# EAGLE design pimotor (EAGLE 6.5.0)
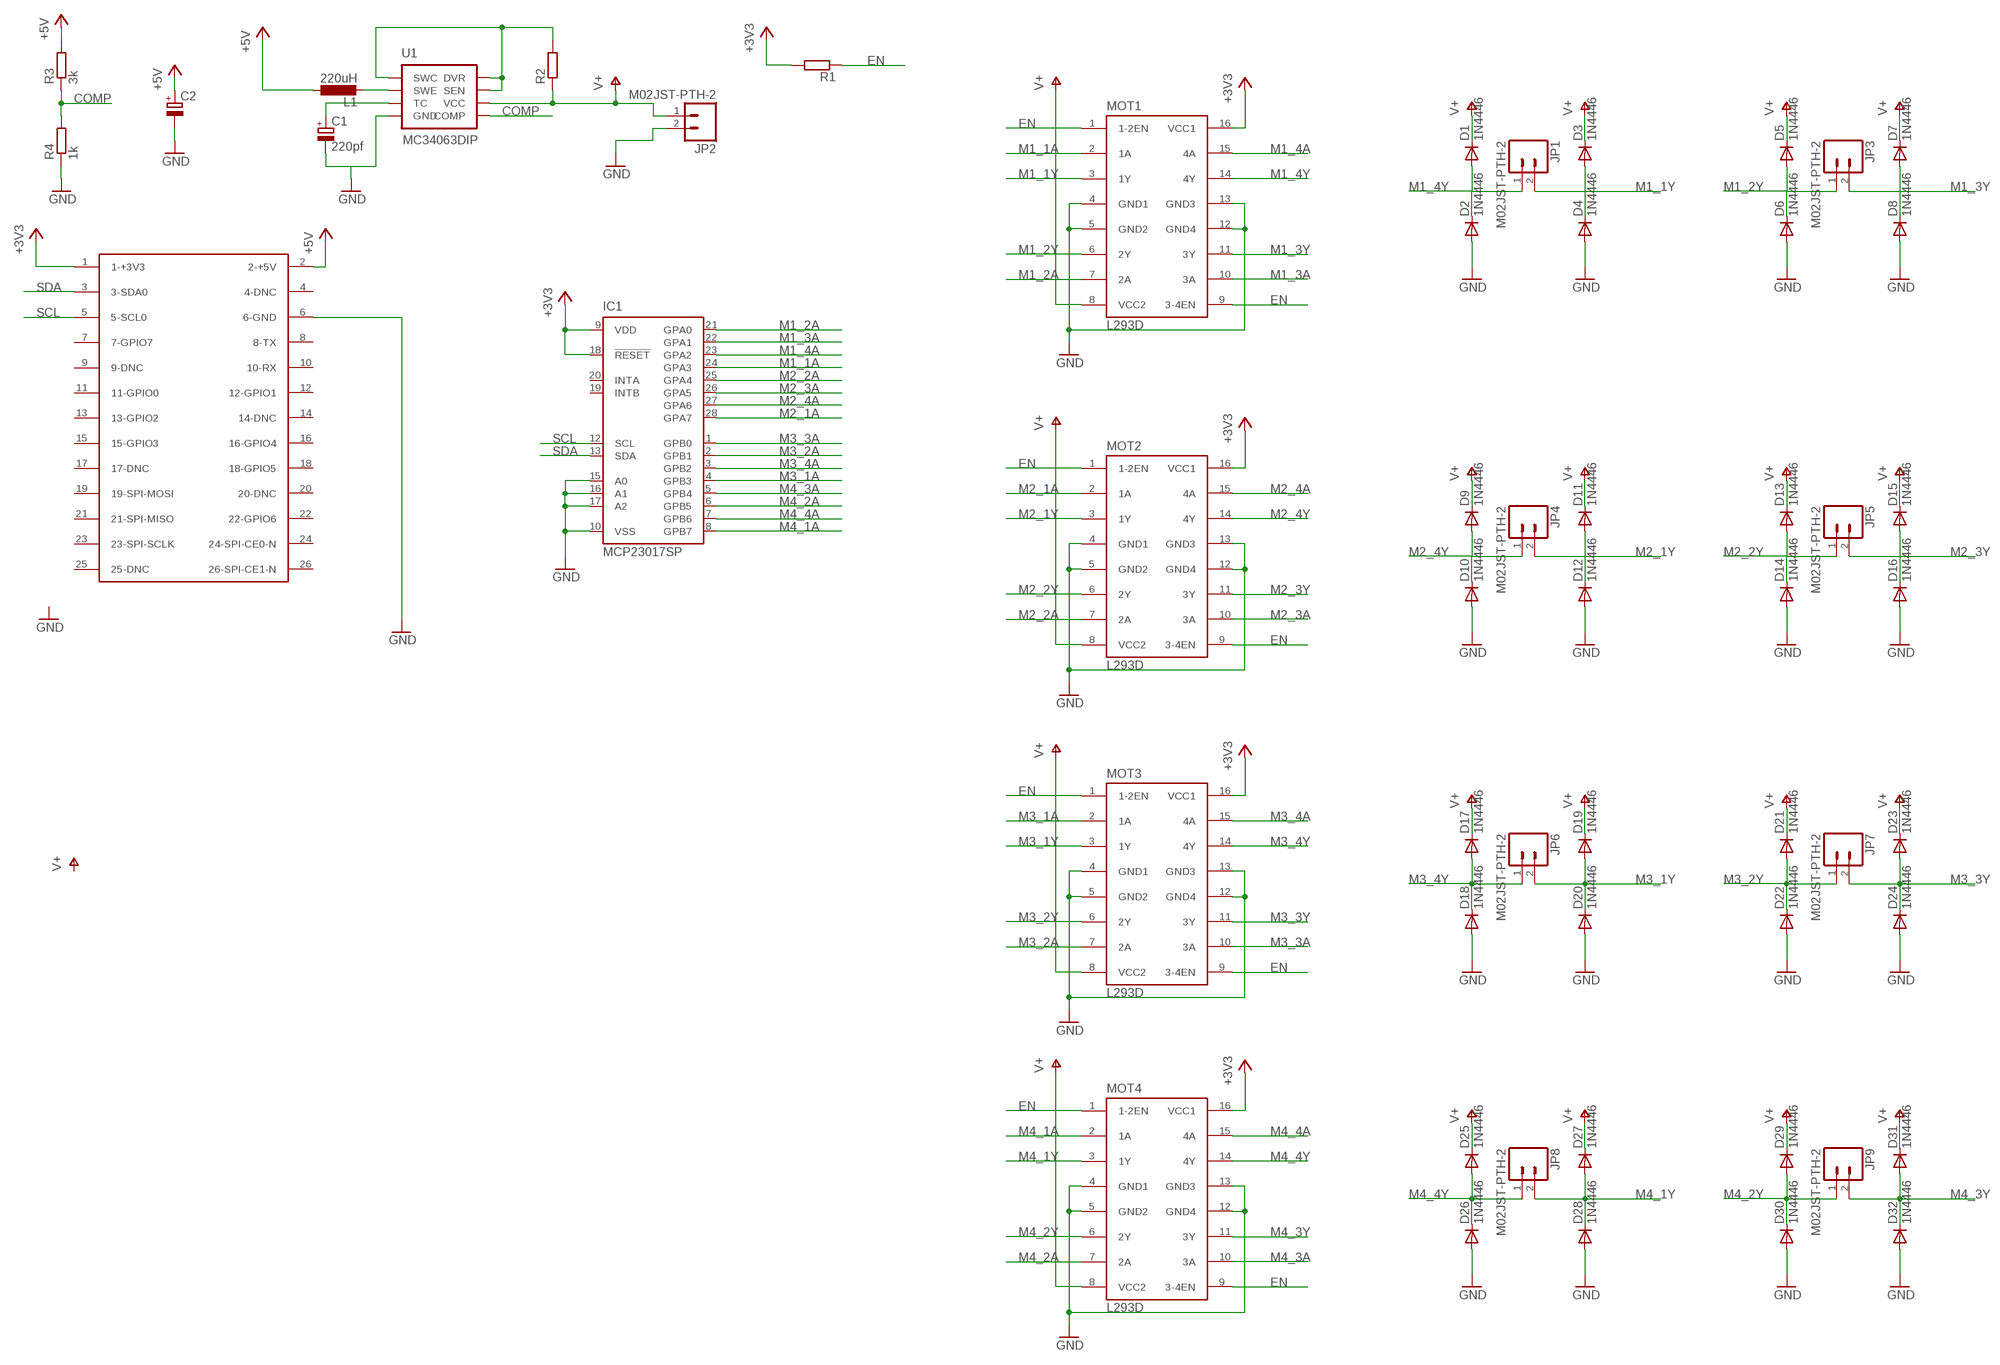
[diagram p0: schematic, sheet 1]

## Parts
C1  220pf  CPOL-EUE3.5-8  [E3,5-8]
C2  CPOL-EUE3.5-8  [E3,5-8]
D1  1N4446  [DO35-10]
D2  1N4446  [DO35-10]
D3  1N4446  [DO35-10]
D4  1N4446  [DO35-10]
D5  1N4446  [DO35-10]
D6  1N4446  [DO35-10]
D7  1N4446  [DO35-10]
D8  1N4446  [DO35-10]
D9  1N4446  [DO35-10]
D10  1N4446  [DO35-10]
D11  1N4446  [DO35-10]
D12  1N4446  [DO35-10]
D13  1N4446  [DO35-10]
D14  1N4446  [DO35-10]
D15  1N4446  [DO35-10]
D16  1N4446  [DO35-10]
D17  1N4446  [DO35-10]
D18  1N4446  [DO35-10]
D19  1N4446  [DO35-10]
D20  1N4446  [DO35-10]
D21  1N4446  [DO35-10]
D22  1N4446  [DO35-10]
D23  1N4446  [DO35-10]
D24  1N4446  [DO35-10]
D25  1N4446  [DO35-10]
D26  1N4446  [DO35-10]
D27  1N4446  [DO35-10]
D28  1N4446  [DO35-10]
D29  1N4446  [DO35-10]
D30  1N4446  [DO35-10]
D31  1N4446  [DO35-10]
D32  1N4446  [DO35-10]
IC1  MCP23017SP  [DIL28-3]
JP1  M02JST-PTH-2  [JST-2-PTH]
JP2  M02JST-PTH-2  [JST-2-PTH]
JP3  M02JST-PTH-2  [JST-2-PTH]
JP4  M02JST-PTH-2  [JST-2-PTH]
JP5  M02JST-PTH-2  [JST-2-PTH]
JP6  M02JST-PTH-2  [JST-2-PTH]
JP7  M02JST-PTH-2  [JST-2-PTH]
JP8  M02JST-PTH-2  [JST-2-PTH]
JP9  M02JST-PTH-2  [JST-2-PTH]
L1  220uH  L-EU0204/7  [0204/7]
MOT1  L293D  [DIL16]
MOT2  L293D  [DIL16]
MOT3  L293D  [DIL16]
MOT4  L293D  [DIL16]
R1  R-EU_0204/7  [0204/7]
R2  R-EU_0204/7  [0204/7]
R3  3k  R-EU_0204/7  [0204/7]
R4  1k  R-EU_0204/7  [0204/7]
U1  MC34063DIP  [DIP-08]
U$1  RASPBERRY-PI  [RASPBERRY-PI]

## Nets
+3V3: IC1.9(VDD) IC1.18(!RESET) MOT1.16(VCC1) MOT2.16(VCC1) MOT3.16(VCC1) MOT4.16(VCC1) R1.2 U$1.1(1-+3V3)
+5V: C2.+ L1.1 R3.2 U$1.2(2-+5V)
COMP: R3.1 R4.2 U1.5(COMP)
EN: MOT1.1(1-2EN) MOT1.9(3-4EN) MOT2.1(1-2EN) MOT2.9(3-4EN) MOT3.1(1-2EN) MOT3.9(3-4EN) MOT4.1(1-2EN) MOT4.9(3-4EN) R1.1
GND: C1.- C2.- D2.A D4.A D6.A D8.A D10.A D12.A D14.A D16.A D18.A D20.A D22.A D24.A D26.A D28.A D30.A D32.A IC1.10(VSS) IC1.15(A0) IC1.16(A1) IC1.17(A2) JP2.2 MOT1.4(GND1) MOT1.5(GND2) MOT1.12(GND4) MOT1.13(GND3) MOT2.4(GND1) MOT2.5(GND2) MOT2.12(GND4) MOT2.13(GND3) MOT3.4(GND1) MOT3.5(GND2) MOT3.12(GND4) MOT3.13(GND3) MOT4.4(GND1) MOT4.5(GND2) MOT4.12(GND4) MOT4.13(GND3) R4.1 U1.4(GND) U$1.6(6-GND)
M1_1A: IC1.24(GPA3) MOT1.2(1A)
M1_1Y: D3.A D4.C JP1.2 MOT1.3(1Y)
M1_2A: IC1.21(GPA0) MOT1.7(2A)
M1_2Y: D5.A D6.C JP3.1 MOT1.6(2Y)
M1_3A: IC1.22(GPA1) MOT1.10(3A)
M1_3Y: D7.A D8.C JP3.2 MOT1.11(3Y)
M1_4A: IC1.23(GPA2) MOT1.15(4A)
M1_4Y: D1.A D2.C JP1.1 MOT1.14(4Y)
M2_1A: IC1.28(GPA7) MOT2.2(1A)
M2_1Y: D11.A D12.C JP4.2 MOT2.3(1Y)
M2_2A: IC1.25(GPA4) MOT2.7(2A)
M2_2Y: D13.A D14.C JP5.1 MOT2.6(2Y)
M2_3A: IC1.26(GPA5) MOT2.10(3A)
M2_3Y: D15.A D16.C JP5.2 MOT2.11(3Y)
M2_4A: IC1.27(GPA6) MOT2.15(4A)
M2_4Y: D9.A D10.C JP4.1 MOT2.14(4Y)
M3_1A: IC1.4(GPB3) MOT3.2(1A)
M3_1Y: D19.A D20.C JP6.2 MOT3.3(1Y)
M3_2A: IC1.2(GPB1) MOT3.7(2A)
M3_2Y: D21.A D22.C JP7.1 MOT3.6(2Y)
M3_3A: IC1.1(GPB0) MOT3.10(3A)
M3_3Y: D23.A D24.C JP7.2 MOT3.11(3Y)
M3_4A: IC1.3(GPB2) MOT3.15(4A)
M3_4Y: D17.A D18.C JP6.1 MOT3.14(4Y)
M4_1A: IC1.8(GPB7) MOT4.2(1A)
M4_1Y: D27.A D28.C JP8.2 MOT4.3(1Y)
M4_2A: IC1.6(GPB5) MOT4.7(2A)
M4_2Y: D29.A D30.C JP9.1 MOT4.6(2Y)
M4_3A: IC1.5(GPB4) MOT4.10(3A)
M4_3Y: D31.A D32.C JP9.2 MOT4.11(3Y)
M4_4A: IC1.7(GPB6) MOT4.15(4A)
M4_4Y: D25.A D26.C JP8.1 MOT4.14(4Y)
N$1: L1.2 U1.2(SWE)
N$2: R2.2 U1.1(SWC) U1.7(SEN) U1.8(DVR)
N$3: C1.+ U1.3(TC)
SCL: IC1.12(SCL) U$1.5(5-SCL0)
SDA: IC1.13(SDA) U$1.3(3-SDA0)
V+: D1.C D3.C D5.C D7.C D9.C D11.C D13.C D15.C D17.C D19.C D21.C D23.C D25.C D27.C D29.C D31.C JP2.1 MOT1.8(VCC2) MOT2.8(VCC2) MOT3.8(VCC2) MOT4.8(VCC2) R2.1 U1.6(VCC)
Unconnected: IC1.19(INTB) IC1.20(INTA) U$1.4(4-DNC) U$1.7(7-GPIO7) U$1.8(8-TX) U$1.9(9-DNC) U$1.10(10-RX) U$1.11(11-GPIO0) U$1.12(12-GPIO1) U$1.13(13-GPIO2) U$1.14(14-DNC) U$1.15(15-GPIO3) U$1.16(16-GPIO4) U$1.17(17-DNC) U$1.18(18-GPIO5) U$1.19(19-SPI-MOSI) U$1.20(20-DNC) U$1.21(21-SPI-MISO) U$1.22(22-GPIO6) U$1.23(23-SPI-SCLK) U$1.24(24-SPI-CE0-N) U$1.25(25-DNC) U$1.26(26-SPI-CE1-N)

## Library data of the parts
C1 C2 = rcl:CPOL-EU: POLARIZED CAPACITOR, European symbol
D1-D32 = diode:1N4446: DIODE high speed (Philips)
IC1 = microchip-update:MCP23017: http://ww1.microchip.com/downloads/en/DeviceDoc/21952a.pdf Source: http://ww1.microchip.com/downloads/en/DeviceDoc/21952a.pdf
JP1-JP9 = SparkFun-Connectors:M02: Standard 2-pin 0.1" header. Use with - straight break away headers ( PRT-00116) - right angle break away headers (PRT-00553) - swiss pins (PRT-00743) - machine pins (PRT-00117) - female headers (PRT-00115) Molex polarized connector foot print use with: PRT-08233 with associated crimp pins and housings. 2.54_SCREWTERM for use with PRT-10571. 3.5mm Screw Terminal footprints for PRT-08084 5mm Screw Terminal footprints for use with PRT-08433; SKU: PRT-09914
L1 = rcl:L-EU: INDUCTOR, European symbol
MOT1-MOT4 = st-microelectronics:L293D: PUSH-PULL 4 CHANNEL DRIVER; MPN: L293D; OC_FARNELL: 9589619; OC_NEWARK: 56P8249
R1-R4 = rcl:R-EU_: RESISTOR, European symbol
U1 = SparkFun-PowerIC:MC34063: Jellybean switching supply controller
U$1 = RaspberryPi:RASPBERRY-PI: Raspberry Pi Board <http://www.raspberrypi.org/> Jacques Lagnel V1.0 (beta) 2012 Board dimension: Forum 3D model <http://www.raspberrypi.org/forum/general-discussion/mechanical-profile-3d-models?value=3d%20model&type=1&include=1&search=1&ret=all> The GPIO Connector (P1): http://elinux.org/RPi_Low-level_peripherals

## Board
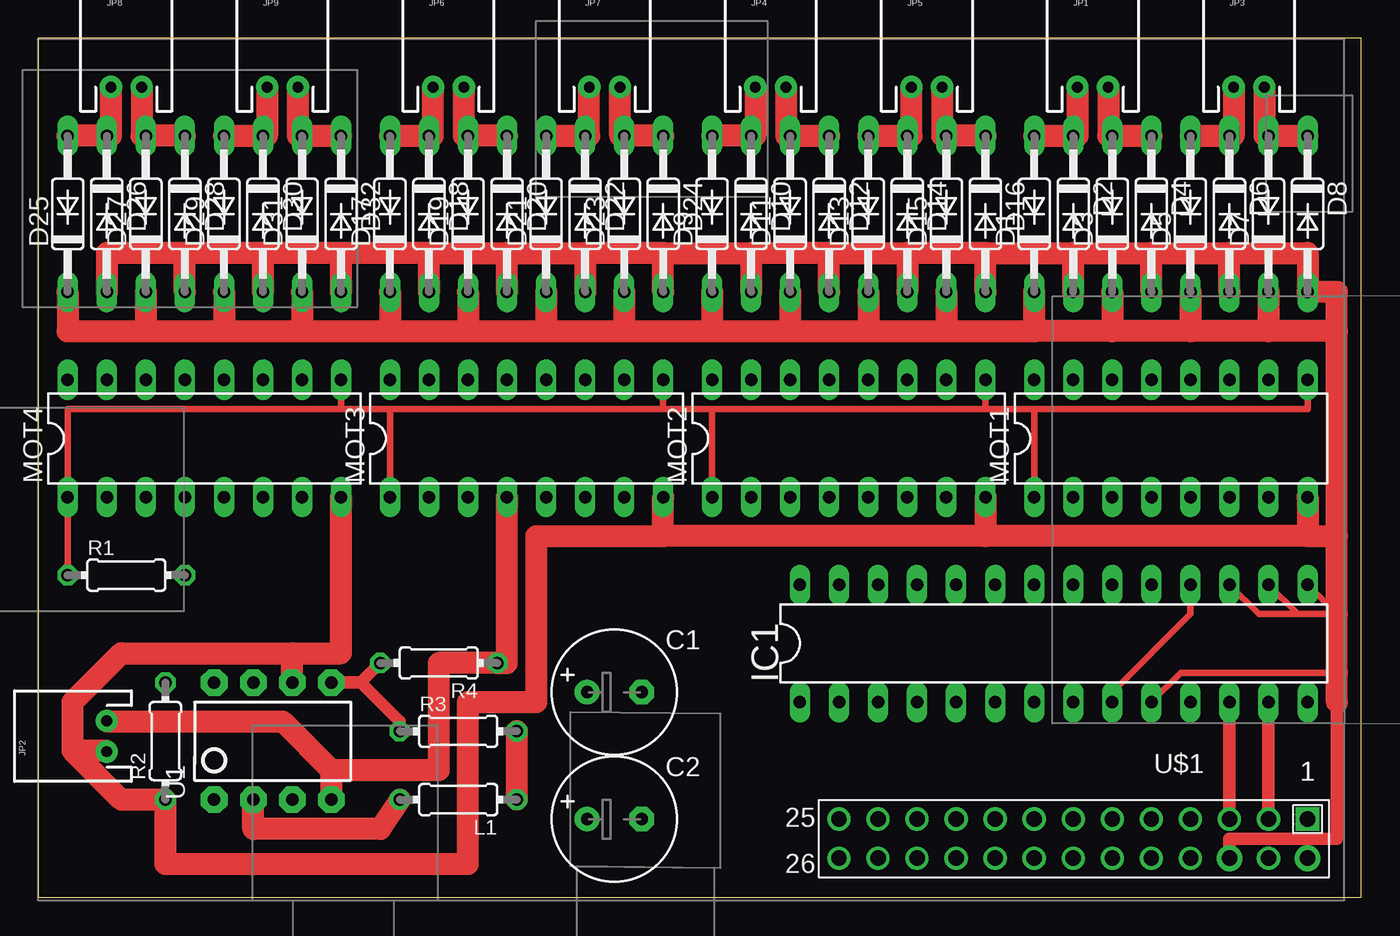
[diagram p1: board, top side]
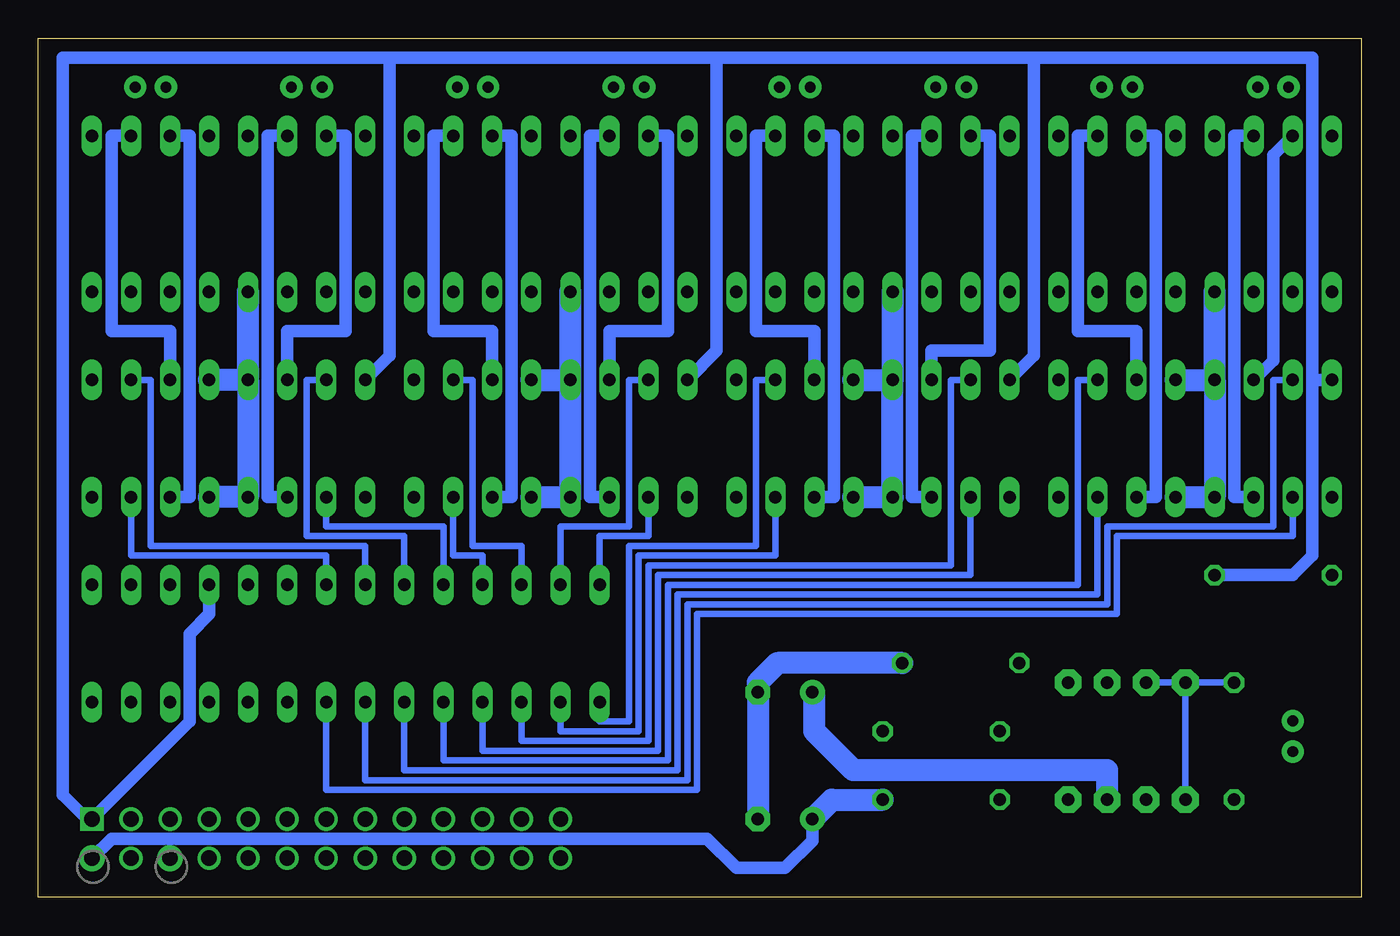
[diagram p2: board, bottom side, seen from below]

Size 86.03 x 55.87 mm. Coordinates in mm from the lower left corner, seen from the top.
Outline: 0,0 86.03,0 86.03,55.87 0,55.87 0,0
Copper layers (1*16): Top 0.035mm / dielectric 1.5mm / Bottom 0.035mm
Design rules "default": minimum track width 10mil, minimum drill 24mil, track to track 8mil, track to pad 8mil, pad to pad 8mil, via to via 8mil, smd to smd 8mil, copper to edge 40mil, drill to drill 8mil, minimum pad ring 10mil, minimum via ring 8mil, stop-mask expansion 4mil, vias tented up to drill 0mil, thermal gap 10mil

### Footprints (pad centres in the part's own frame; a part is rotated, then mirrored left to right if it is on the bottom)
E3,5-8 = drill 0.813 pad 1.6: + -1.778,0 | drill 0.813 pad 1.6 octagon: - 1.778,0
DO35-10 = drill 0.813 long: A 5.08,0; C -5.08,0
DIL28-3 = drill 0.813 long: 1 -16.51,-3.81; 2 -13.97,-3.81; 3 -11.43,-3.81; 4 -8.89,-3.81; 5 -6.35,-3.81; 6 -3.81,-3.81; 7 -1.27,-3.81; 8 1.27,-3.81; 9 3.81,-3.81; 10 6.35,-3.81; 11 8.89,-3.81; 12 11.43,-3.81; 13 13.97,-3.81; 14 16.51,-3.81; 15 16.51,3.81; 16 13.97,3.81; 17 11.43,3.81; 18 8.89,3.81; 19 6.35,3.81; 20 3.81,3.81; 21 1.27,3.81; 22 -1.27,3.81; 23 -3.81,3.81; 24 -6.35,3.81; 25 -8.89,3.81; 26 -11.43,3.81; 27 -13.97,3.81; 28 -16.51,3.81
JST-2-PTH = drill 0.7 pad 1.448: 1 -1,0; 2 1,0
0204/7 = drill 0.813 octagon: 1 -3.81,0; 2 3.81,0
DIL16 = drill 0.813 long: 1 -8.89,-3.81; 2 -6.35,-3.81; 3 -3.81,-3.81; 4 -1.27,-3.81; 5 1.27,-3.81; 6 3.81,-3.81; 7 6.35,-3.81; 8 8.89,-3.81; 9 8.89,3.81; 10 6.35,3.81; 11 3.81,3.81; 12 1.27,3.81; 13 -1.27,3.81; 14 -3.81,3.81; 15 -6.35,3.81; 16 -8.89,3.81
DIP-08 = drill 0.813 pad 1.727 octagon: 1 -3.81,-3.81; 2 -1.27,-3.81; 3 1.27,-3.81; 4 3.81,-3.81; 5 3.81,3.81; 6 1.27,3.81; 7 -1.27,3.81; 8 -3.81,3.81
RASPBERRY-PI = drill 1 square: 1 0,0 | drill 1 pad 1.676: 2 0,2.54; 6 5.08,2.54 | drill 1: 3 2.54,0; 4 2.54,2.54; 5 5.08,0; 7 7.62,0; 8 7.62,2.54; 9 10.16,0; 10 10.16,2.54; 11 12.7,0; 12 12.7,2.54; 13 15.24,0; 14 15.24,2.54; 15 17.78,0; 16 17.78,2.54; 17 20.32,0; 18 20.32,2.54; 19 22.86,0; 20 22.86,2.54; 21 25.4,0; 22 25.4,2.54; 23 27.94,0; 24 27.94,2.54; 25 30.48,0; 26 30.48,2.54

### Placement (x,y rotation side)
C1  37.47,13.34 0 top
C2  37.47,5.08 0 top
D1  64.77,44.45 90 top
D2  67.31,44.45 270 top
D3  69.85,44.45 90 top
D4  72.39,44.45 270 top
D5  74.93,44.45 90 top
D6  77.47,44.45 270 top
D7  80.01,44.45 90 top
D8  82.55,44.45 270 top
D9  43.81,44.45 90 top
D10  46.35,44.45 270 top
D11  48.9,44.45 90 top
D12  51.44,44.45 270 top
D13  53.98,44.45 90 top
D14  56.52,44.45 270 top
D15  59.05,44.45 90 top
D16  61.59,44.45 270 top
D17  22.86,44.45 90 top
D18  25.4,44.45 270 top
D19  27.94,44.45 90 top
D20  30.48,44.45 270 top
D21  33.02,44.45 90 top
D22  35.56,44.45 270 top
D23  38.1,44.45 90 top
D24  40.64,44.45 270 top
D25  1.91,44.45 90 top
D26  4.45,44.45 270 top
D27  6.99,44.45 90 top
D28  9.53,44.45 270 top
D29  12.06,44.45 90 top
D30  14.61,44.45 270 top
D31  17.14,44.45 90 top
D32  19.68,44.45 270 top
IC1  66.04,16.51 0 top
JP1  68.58,52.7 0 top
JP2  4.45,10.48 90 top
JP3  78.74,52.7 0 top
JP4  47.62,52.7 0 top
JP5  57.78,52.7 0 top
JP6  26.67,52.7 0 top
JP7  36.83,52.7 0 top
JP8  5.71,52.7 0 top
JP9  15.88,52.7 0 top
L1  27.3,6.35 180 top
MOT1  73.66,29.84 0 top
MOT2  52.7,29.84 0 top
MOT3  31.75,29.84 0 top
MOT4  10.79,29.84 0 top
R1  5.71,20.95 0 top
R2  8.26,10.16 90 top
R3  27.3,10.79 0 top
R4  26.04,15.24 180 top
U1  15.24,10.16 0 top
U$1  82.55,5.08 180 top

### Tracks (layer width: path | path; a pad name or v marks a point on that pad's centre or on a via)
+3V3
  Top 0.406: IC1.18 74.93,18.41 69.85,13.34 IC1.9
  Bottom 0.813: 3.17,33.66 MOT4.16 | IC1.18 74.93,18.41 76.2,17.14 76.2,11.43 U$1.1 82.87,5.08 84.45,6.67 84.45,54.61 63.18,54.61 | 21.27,54.61 21.27,35.24 MOT3.16 | MOT2.16 41.91,35.56 41.91,54.61 | 41.91,54.61 63.18,54.61 | 41.91,54.61 21.27,54.61 | MOT1.16 63.18,35.24 63.18,54.61 | 3.17,33.66 3.17,54.61 21.27,54.61 | 3.17,33.66 3.17,22.23 4.45,20.95 R1.2
+5V
  Top 1.422: R3.2 L1.1
  Bottom 0.813: U$1.2 81.28,3.81 42.55,3.81 40.64,1.91 37.47,1.91 35.69,3.68 C2.+
  Bottom 1.422: C2.+ 34.42,6.35 L1.1
COMP
  Top 0.813: U1.5 20.95,13.97 | 20.95,13.97 R4.2 | R3.1 23.5,11.43 20.95,13.97
EN
  Top 0.406: R1.1 MOT4.1 1.91,31.75 19.68,31.75 | MOT1.9 82.55,31.75 64.77,31.75 | 64.77,31.75 61.59,31.75 | 61.59,31.75 MOT2.9 | MOT1.1 64.77,31.75 | 61.59,31.75 43.81,31.75 | 43.81,31.75 40.64,31.75 | 40.64,31.75 MOT3.9 | MOT2.1 43.81,31.75 | 40.64,31.75 22.86,31.75 | 22.86,31.75 19.68,31.75 | 19.68,31.75 MOT4.9 | MOT3.1 22.86,31.75
GND
  Top 0.406: IC1.10 74.3,14.61 84.45,14.61 | IC1.17 79.38,18.41 81.92,18.41 | 81.92,18.41 84.45,18.41 IC1.15 | IC1.16 81.92,18.41
  Top 0.813: U$1.6 77.47,3.81 84.45,3.81 84.45,12.7
  Top 1.422: 67.31,41.91 72.39,41.91 | D6.A 77.47,41.91 | 77.47,41.91 82.55,41.91 D8.A 84.45,39.37 84.45,18.41 84.45,14.61 84.45,12.7 | D4.A 72.39,41.91 | 72.39,41.91 77.47,41.91 | D2.A 67.31,41.91 | 61.59,41.91 67.31,41.91 | D16.A 61.59,41.91 | 61.59,41.91 56.52,41.91 | 56.52,41.91 D14.A | 51.44,41.91 46.35,41.91 | 46.35,41.91 D10.A | D12.A 51.44,41.91 | 51.44,41.91 56.52,41.91 | 40.64,41.91 46.35,41.91 | D24.A 40.64,41.91 | 40.64,41.91 35.56,41.91 | 35.56,41.91 D22.A | D20.A 30.48,41.91 | 30.48,41.91 35.56,41.91 | 25.4,41.91 30.48,41.91 | D18.A 25.4,41.91 | 25.4,41.91 19.68,41.91 | 19.68,41.91 14.61,41.91 | 14.61,41.91 9.53,41.91 | 9.53,41.91 4.45,41.91 D26.A | D32.A 19.68,41.91 | D30.A 14.61,41.91 | D28.A 9.53,41.91 | 19.05,8.26 26.04,8.26 26.04,15.24 R4.1 30.48,15.24 MOT3.4 | 19.05,8.26 U1.4 | JP2.2 4.49,11.43 15.88,11.43 19.05,8.26
  Bottom 1.422: MOT4.5 MOT4.4 MOT4.13 | MOT1.13 MOT1.12 | MOT1.13 MOT1.4 MOT1.5 | MOT2.12 MOT2.13 | MOT3.5 MOT3.4 MOT3.13 | MOT3.12 MOT3.13 | MOT1.13 D4.A | MOT2.5 MOT2.4 MOT2.13 | MOT2.13 D12.A | MOT4.13 D28.A | MOT4.12 MOT4.13 | D20.A MOT3.13 | R4.1 37.97,15.24 39.24,13.97 C1.- C2.-
M1_1A
  Bottom 0.406: IC1.24 59.69,24.13 67.31,24.13 MOT1.2
M1_1Y
  Top 1.422: D4.C D3.A 69.58,49.53 JP1.2
  Bottom 0.813: MOT1.3 71.12,26.04 71.12,49.53 D3.A
M1_2A
  Bottom 0.406: IC1.21 67.31,22.23 80.01,22.23 MOT1.7
M1_2Y
  Top 1.422: D5.A D6.C 77.74,49.53 JP3.1
  Bottom 0.813: MOT1.6 76.2,26.04 76.2,49.53 D6.C
M1_3A
  Bottom 0.406: IC1.22 64.77,22.86 78.74,22.86 78.74,33.66 MOT1.10
M1_3Y
  Top 1.422: D8.C D7.A 79.74,49.53 JP3.2
  Bottom 0.813: MOT1.11 77.47,36.83 81.28,36.83 81.28,49.53 D7.A
M1_4A
  Bottom 0.406: IC1.23 62.23,23.5 68.58,23.5 68.58,33.66 MOT1.15
M1_4Y
  Top 1.422: D1.A D2.C 67.58,49.53 JP1.1
  Bottom 0.813: MOT1.14 69.85,36.83 66.04,36.83 66.04,49.53 D2.C
M2_1A
  Bottom 0.406: IC1.28 49.53,23.5 46.35,23.5 MOT2.2
M2_1Y
  Top 1.422: JP4.2 48.62,49.53 D11.A D12.C
  Bottom 0.813: MOT2.3 50.16,26.04 50.16,49.53 D11.A
M2_2A
  Bottom 0.406: IC1.25 57.15,22.23 59.05,22.23 MOT2.7
M2_2Y
  Top 1.422: D13.A D14.C 56.78,49.53 JP5.1
  Bottom 0.813: MOT2.6 55.24,26.04 55.24,49.53 D14.C
M2_3A
  Bottom 0.406: IC1.26 54.61,22.86 57.78,22.86 57.78,33.66 MOT2.10
M2_3Y
  Top 1.422: JP5.2 58.78,49.53 D15.A D16.C
  Bottom 0.813: D15.A 60.33,49.53 60.33,36.83 56.52,36.83 MOT2.11
M2_4A
  Bottom 0.406: IC1.27 52.07,24.13 47.62,24.13 47.62,33.66 MOT2.15
M2_4Y
  Top 1.422: JP4.1 46.62,49.53 D10.C D9.A
  Bottom 0.813: MOT2.14 48.9,36.83 45.09,36.83 45.09,49.53 D10.C
M3_1A
  Bottom 0.406: IC1.4 57.15,9.53 45.72,9.53 45.72,20.95 25.4,20.95 25.4,21.59 MOT3.2
M3_1Y
  Top 1.422: D20.C D19.A 27.67,49.53 JP6.2
  Bottom 0.813: MOT3.3 29.21,26.04 29.21,49.53 D19.A
M3_2A
  Bottom 0.406: IC1.2 52.07,10.79 46.99,10.79 46.99,22.23 38.1,22.23 MOT3.7
M3_2Y
  Top 1.422: D21.A D22.C 35.83,49.53 JP7.1
  Bottom 0.813: MOT3.6 34.29,26.04 34.29,49.53 D22.C
M3_3A
  Bottom 0.406: IC1.1 49.53,11.43 47.62,11.43 47.62,22.86 39.37,22.86 39.37,33.66 MOT3.10
M3_3Y
  Top 1.422: D24.C D23.A 37.83,49.53 JP7.2
  Bottom 0.813: MOT3.11 35.56,36.83 39.37,36.83 39.37,49.53 D23.A
M3_4A
  Bottom 0.406: IC1.3 54.61,10.16 46.35,10.16 46.35,21.59 26.67,21.59 26.67,22.86 26.67,33.66 MOT3.15
M3_4Y
  Top 1.422: D17.A D18.C 25.67,49.53 JP6.1
  Bottom 0.813: MOT3.14 27.94,35.56 24.13,35.56 24.13,49.53 D18.C
M4_1A
  Bottom 0.406: IC1.8 67.31,6.99 43.18,6.99 43.18,18.41 15.88,18.41 15.88,23.5 4.45,23.5 MOT4.2
M4_1Y
  Top 1.422: JP8.2 6.71,49.53 D27.A D28.C
  Bottom 0.813: MOT4.3 8.26,26.04 8.26,49.53 D27.A
M4_2A
  Bottom 0.406: IC1.6 62.23,8.26 44.45,8.26 44.45,19.68 17.14,19.68 17.14,21.59 MOT4.7
M4_2Y
  Top 1.422: D29.A D30.C 14.88,49.53 JP9.1
  Bottom 0.813: MOT4.6 13.34,26.04 13.34,49.53 D30.C
M4_3A
  Bottom 0.406: IC1.5 59.69,8.89 45.09,8.89 45.09,20.32 18.41,20.32 18.41,21.59 18.41,33.66 MOT4.10
M4_3Y
  Top 1.422: D32.C D31.A 16.88,49.53 JP9.2
  Bottom 0.813: MOT4.11 14.61,36.83 18.41,36.83 18.41,49.53 D31.A
M4_4A
  Bottom 0.406: IC1.7 64.77,7.62 43.81,7.62 43.81,19.05 16.51,19.05 16.51,24.13 5.71,24.13 5.71,33.66 MOT4.15
M4_4Y
  Top 1.422: JP8.1 4.71,49.53 D26.C D25.A
  Bottom 0.813: MOT4.14 5.71,34.92 5.71,48.26 D26.C
N$1
  Top 1.422: L1.2 22.23,4.45 13.97,4.45 U1.2
N$2
  Bottom 0.406: R2.2 U1.8 | U1.8 U1.7 | U1.8 U1.1
N$3
  Bottom 1.422: U1.3 16.51,8.26 33.02,8.26 35.56,10.79 35.56,13.21 C1.+
SCL
  Top 0.813: U$1.5 IC1.12
SDA
  Top 0.813: U$1.3 IC1.13
V+
  Top 1.422: 40.64,23.5 32.38,23.5 32.38,12.7 27.94,12.7 27.94,2.17 8.26,2.17 R2.1 5.4,6.35 2.22,9.53 | 40.64,23.5 MOT3.8 | U1.6 16.51,15.88 | 16.51,15.88 19.68,15.88 MOT4.8 | MOT2.8 61.59,23.5 | 61.59,23.5 40.64,23.5 | 82.55,23.5 61.59,23.5 | D3.C 69.85,36.83 | 69.85,36.83 64.77,36.83 | 64.77,36.83 D1.C | D5.C 74.93,36.83 | 74.93,36.83 69.85,36.83 | D7.C 80.01,36.83 | 80.01,36.83 74.93,36.83 | MOT1.8 82.55,23.5 | 82.55,23.5 84.45,23.5 84.45,36.83 80.01,36.83 | 53.98,36.83 59.05,36.83 | D13.C 53.98,36.83 | D15.C 59.05,36.83 | D9.C 43.81,36.83 | 43.81,36.83 48.9,36.83 | 48.9,36.83 53.98,36.83 | D11.C 48.9,36.83 | D21.C 33.02,36.83 | 33.02,36.83 38.1,36.83 | 38.1,36.83 43.81,36.83 | D23.C 38.1,36.83 | D17.C 22.86,36.83 | 22.86,36.83 27.94,36.83 | 27.94,36.83 33.02,36.83 | D19.C 27.94,36.83 | D27.C 6.99,36.83 | 6.99,36.83 12.06,36.83 | 12.06,36.83 17.14,36.83 | 17.14,36.83 22.86,36.83 | D25.C 1.91,36.83 6.99,36.83 | D29.C 12.06,36.83 | D31.C 17.14,36.83 | 59.05,36.83 64.77,36.83 | JP2.1 4.4,9.53 2.22,9.53 | 2.22,9.53 2.22,12.7 5.4,15.88 16.51,15.88